# Altium schematic sheet PAGE2-MCU,LORA.SchDoc (part 1 of 2)
size A3
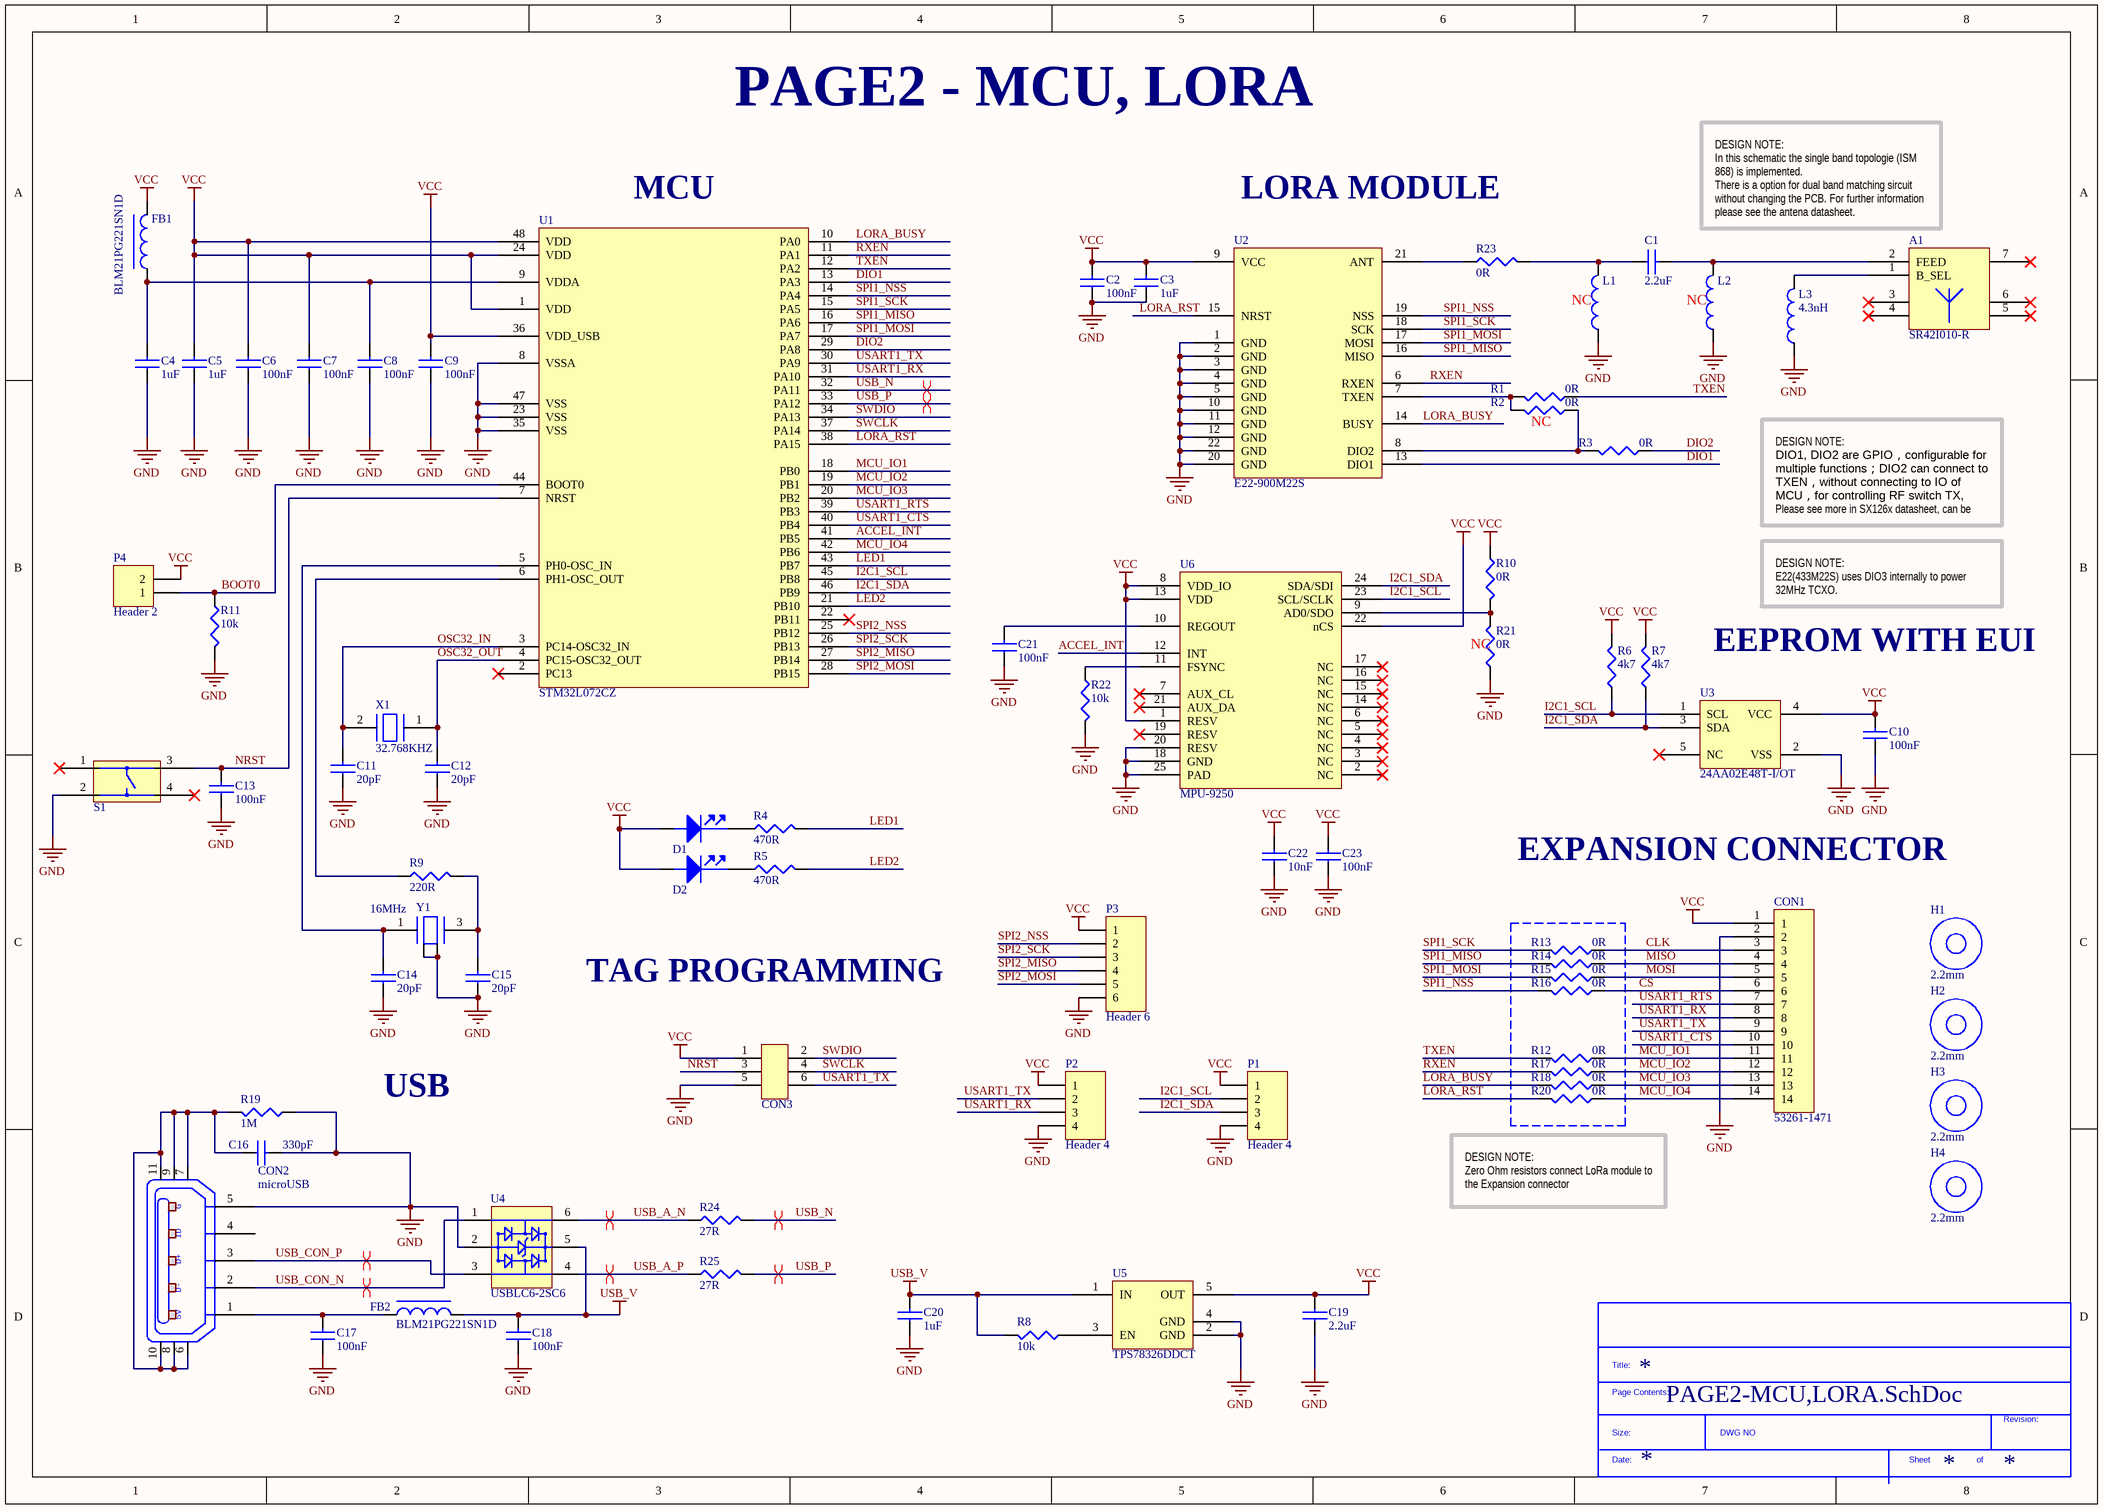
[diagram p0: PAGE2-MCU,LORA.SchDoc]

## Parts
*?  SDTitleBlock  (value not drawn)  (graphical)
A1  SR42I010-R  [LORA_PCB_ANTENNA]
C1  2.2uF  [CAP0402]
C2  100nF  [CAP0603]
C3  1uF  [CAP0603]
C4  1uF  [CAP0603]
C5  1uF  [CAP0603]
C6  100nF  [CAP0603]
C7  100nF  [CAP0603]
C8  100nF  [CAP0603]
C9  100nF  [CAP0603]
C10  100nF  [CAP0603]
C11  20pF  [CAP0603]
C12  20pF  [CAP0603]
C13  100nF  [CAP0603]
C14  20pF  [CAP0603]
C15  20pF  [CAP0603]
C16  330pF  [CAP0603]
C17  100nF  [CAP0603]
C18  100nF  [CAP0603]
C19  2.2uF  [CAP0805]
C20  1uF  [CAP0603]
C21  100nF  [CAP0603]
C22  10nF  [CAP0603]
C23  100nF  [CAP0603]
CON1  53261-1471  [53261-1471]
CON2  microUSB  [microUSB-CHINA]
CON3  Tag connect  [TC2030-IDC-NL]  (value not drawn)  (no BOM)
D1  LED RED  [LED0603]  (value not drawn)
D2  LED RED  [LED0603]  (value not drawn)
FB1  BLM21PG221SN1D  [IND0805]
FB2  BLM21PG221SN1D  [IND0805]
H1  2.2mm  [hole]  (no BOM)
H2  2.2mm  [hole]  (no BOM)
H3  2.2mm  [hole]  (no BOM)
H4  2.2mm  [hole]  (no BOM)
L1  33nH  [IND0402]  (value not drawn)
L2  33nH  [IND0402]  (value not drawn)
L3  4.3nH  [IND0402]
P1  Header 4  [HDR1X4]
P2  Header 4  [HDR1X4]
P3  Header 6  [HDR1X6]
P4  Header 2  [HDR1X2]  (no BOM)
R1  0R  [RES0603]
R2  0R  [RES0603]
R3  0R  [RES0603]
R4  470R  [RES0603]
R5  470R  [RES0603]
R6  4k7  [RES0603]
R7  4k7  [RES0603]
R8  10k  [RES0603]
R9  220R  [RES0603]
R10  0R  [RES0603]
R11  10k  [RES0603]
R12  0R  [RES0603]
R13  0R  [RES0603]
R14  0R  [RES0603]
R15  0R  [RES0603]
R16  0R  [RES0603]
R17  0R  [RES0603]
R18  0R  [RES0603]
R19  1M  [RES0603]
R20  0R  [RES0603]
R21  0R  [RES0603]
R22  10k  [RES0603]
R23  0R  [RES0402]
R24  27R  [RES0603]
R25  27R  [RES0603]
S1  KMR221NGLFS  [SW]  (value not drawn)
U1  STM32L072CZ  [TSQFP50P900X900X160-48N]
U2  E22-900M22S  [E22-900M22S]
U3  24AA02E48T-I/OT  [SOT95P280X145-5N]
U4  USBLC6-2SC6  [SOT95P280X145-6N]
U5  TPS78326DDCT  [SOT95P280X145-5N]
U6  MPU-9250  [QFN40P300X300X105_HS-25N]
X1  32.768KHZ  [CRY2X1.2]
Y1  16MHz  [CRY2.5X2]

## Nets
GND: C2.1 C3.1 C4.1 C5.1 C6.1 C7.1 C8.1 C9.1 C10.1 C11.1 C12.1 C13.1 C14.1 C15.1 C16.2 C17.1 C18.1 C19.1 C20.1 C21.1 C22.1 C23.1 CON1.2 CON2.5(P5) CON3.5 L1.1 L2.1 L3.1 P1.4 P2.4 P3.6 R11.2 R19.1 R21.1 R22.2 S1.2 U1.8(VSSA) U1.23(VSS) U1.35(VSS) U1.47(VSS) U2.1(GND) U2.2(GND) U2.3(GND) U2.4(GND) U2.5(GND) U2.10(GND) U2.11(GND) U2.12(GND) U2.20(GND) U2.22(GND) U3.2(VSS) U4.2 U5.2(GND) U5.4(GND) U6.18(GND) U6.20(RESV) U6.25(PAD) Y1.2 Y1.4
USB_V: C18.2 C20.2 FB2.2 R8.2 U4.5 U5.1(IN)
VCC: C2.2 C3.2 C5.2 C6.2 C7.2 C9.2 C10.2 C19.2 C22.2 C23.2 CON1.1 CON3.1 D1.2(ANODE) D2.2(ANODE) FB1.2 P1.1 P2.1 P3.1 P4.2 R6.2 R7.2 R10.1 U1.1(VDD) U1.24(VDD) U1.36(VDD_USB) U1.48(VDD) U2.9(VCC) U3.4(VCC) U5.5(OUT) U6.1(RESV) U6.8(VDD_IO) U6.13(VDD) U6.22(nCS)
ACCEL_INT: U1.41(PB5) U6.12(INT)
BOOT0: P4.1 R11.1 U1.44(BOOT0)
CLK: CON1.3 R13.1
CS: CON1.6 R16.1
DIO1: U1.13(PA3) U2.13(DIO1)
DIO2: R3.1 U1.29(PA8)
I2C1_SCL: P1.2 R6.1 U1.45(PB8) U3.1(SCL) U6.23(SCL/SCLK)
I2C1_SDA: P1.3 R7.1 U1.46(PB9) U3.3(SDA) U6.24(SDA/SDI)
LED1: R4.2 U1.43(PB7)
LED2: R5.2 U1.21(PB10)
LORA_BUSY: R18.2 U1.10(PA0) U2.14(BUSY)
LORA_RST: R20.2 U1.38(PA15) U2.15(NRST)
MCU_IO1: CON1.11 R12.1 U1.18(PB0)
MCU_IO2: CON1.12 R17.1 U1.19(PB1)
MCU_IO3: CON1.13 R18.1 U1.20(PB2)
MCU_IO4: CON1.14 R20.1 U1.42(PB6)
MISO: CON1.4 R14.1
MOSI: CON1.5 R15.1
NRST: C13.2 CON3.3 S1.3 U1.7(NRST)
OSC32_IN: C11.2 U1.3(PC14-OSC32_IN) X1.2
OSC32_OUT: C12.2 U1.4(PC15-OSC32_OUT) X1.1
RXEN: R17.2 U1.11(PA1) U2.6(RXEN)
SPI1_MISO: R14.2 U1.16(PA6) U2.16(MISO)
SPI1_MOSI: R15.2 U1.17(PA7) U2.17(MOSI)
SPI1_NSS: R16.2 U1.14(PA4) U2.19(NSS)
SPI1_SCK: R13.2 U1.15(PA5) U2.18(SCK)
SPI2_MISO: P3.4 U1.27(PB14)
SPI2_MOSI: P3.5 U1.28(PB15)
SPI2_NSS: P3.2 U1.25(PB12)
SPI2_SCK: P3.3 U1.26(PB13)
SWCLK: CON3.4 U1.37(PA14)
SWDIO: CON3.2 U1.34(PA13)
TXEN: R1.1 R12.2 U1.12(PA2)
USART1_CTS: CON1.10 U1.40(PB4)
USART1_RTS: CON1.7 U1.39(PB3)
USART1_RX: CON1.8 P2.3 U1.31(PA10)
USART1_TX: CON1.9 CON3.6 P2.2 U1.30(PA9)
USB_A_N: R24.1 U4.6
USB_A_P: R25.1 U4.4
USB_CON_N: CON2.2(P2) U4.1
USB_CON_P: CON2.3(P3) U4.3
USB_N: R24.2 U1.32(PA11)
USB_P: R25.2 U1.33(PA12)
NetA1_1: A1.1(B_SEL) L3.2
NetA1_2: A1.2(FEED) C1.2 L2.2
NetC1_1: C1.1 L1.2 R23.2
NetC4_2: C4.2 C8.2 FB1.1 U1.9(VDDA)
NetC14_2: C14.2 U1.5(PH0-OSC_IN) Y1.1
NetC15_2: C15.2 R9.2 Y1.3
NetC16_1: C16.1 CON2.6 CON2.7 CON2.8 CON2.9 CON2.10 CON2.11 R19.2
NetC17_2: C17.2 CON2.1(P1) FB2.1
NetC21_2: C21.2 U6.10(REGOUT)
NetD1_1: D1.1(cathode) R4.1
NetD2_1: D2.1(cathode) R5.1
NetR1_2: R1.2 R2.2 U2.7(TXEN)
NetR2_1: R2.1 R3.2 U2.8(DIO2)
NetR8_1: R8.1 U5.3(EN)
NetR9_1: R9.1 U1.6(PH1-OSC_OUT)
NetR10_2: R10.2 R21.2 U6.9(AD0/SDO)
NetR22_1: R22.1 U6.11(FSYNC)
NetR23_1: R23.1 U2.21(ANT)

Not connected (* = marked no-connect by the designer): A1 3* 4* 5* 6* 7*; CON2 4(P4); S1 1* 4*; U1 2(PC13)* 22(PB11)*; U3 5(NC)*; U6 2(NC)* 3(NC)* 4(NC)* 5(NC)* 6(NC)* 7(AUX_CL)* 14(NC)* 15(NC)* 16(NC)* 17(NC)* 19(RESV)* 21(AUX_DA)*

## Layout directives
differential pair: USB_A_N, USB_A_P, USB_CON_N, USB_CON_P, USB_N, USB_P

## Notes on the sheet
- PAGE2 - MCU, LORA
- (near U1) MCU
- LORA MODULE
- DESIGN NOTE:
  In this schematic the single band topologie (ISM 868) is implemented.
  There is a option for dual band matching sircuit without changing the PCB. For further information please see the antena datasheet.
- (near L1) NC
- (near L2) NC
- (near R2) NC
- DESIGN NOTE:
  DIO1, DIO2 are GPIO，configurable for multiple functions；DIO2 can connect to TXEN，without connecting to IO of MCU，for controlling RF switch TX, Please see more in SX126x datasheet, can be floated when free.
- (near R21) NC
- DESIGN NOTE:
  E22(433M22S) uses DIO3 internally to power 32MHz TCXO.
- EEPROM WITH EUI
- EXPANSION CONNECTOR
- TAG PROGRAMMING
- USB
- DESIGN NOTE:
  Zero Ohm resistors connect LoRa module to the Expansion connector
- (in symbol Micro USB CHINA 1) G; ID; D+; D-; 5V
- (in symbol SDTitleBlock) Title:; Page Contents:; Revision:; Size:; DWG NO; Date:; Sheet; of